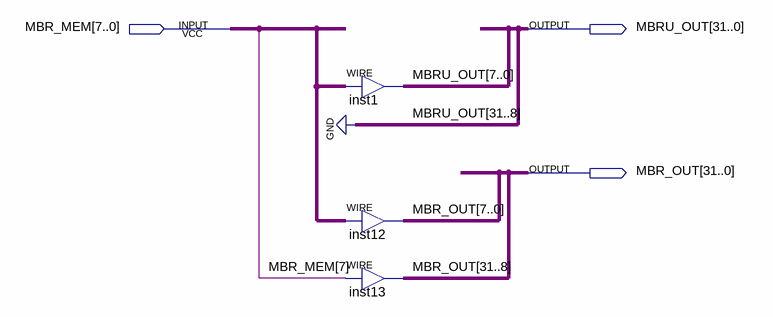
[diagram p0: schematic sheet]
// Quartus schematic MBR_extensor.bdf as structural Verilog: 3 symbols, 3 pins
module MBR_extensor (
  input  [7:0] MBR_MEM,
  output [31:0] MBRU_OUT,
  output [31:0] MBR_OUT
);

  assign MBRU_OUT[7:0] = MBR_MEM;  // WIRE inst1
  assign MBR_OUT[7:0] = MBR_MEM;  // WIRE inst12
  assign MBR_OUT[31:8] = {24{MBR_MEM[7]}};  // WIRE inst13

  assign MBRU_OUT[31:8] = {24{1'b0}};
endmodule
